# Altium project hri_hand.PrjPcb
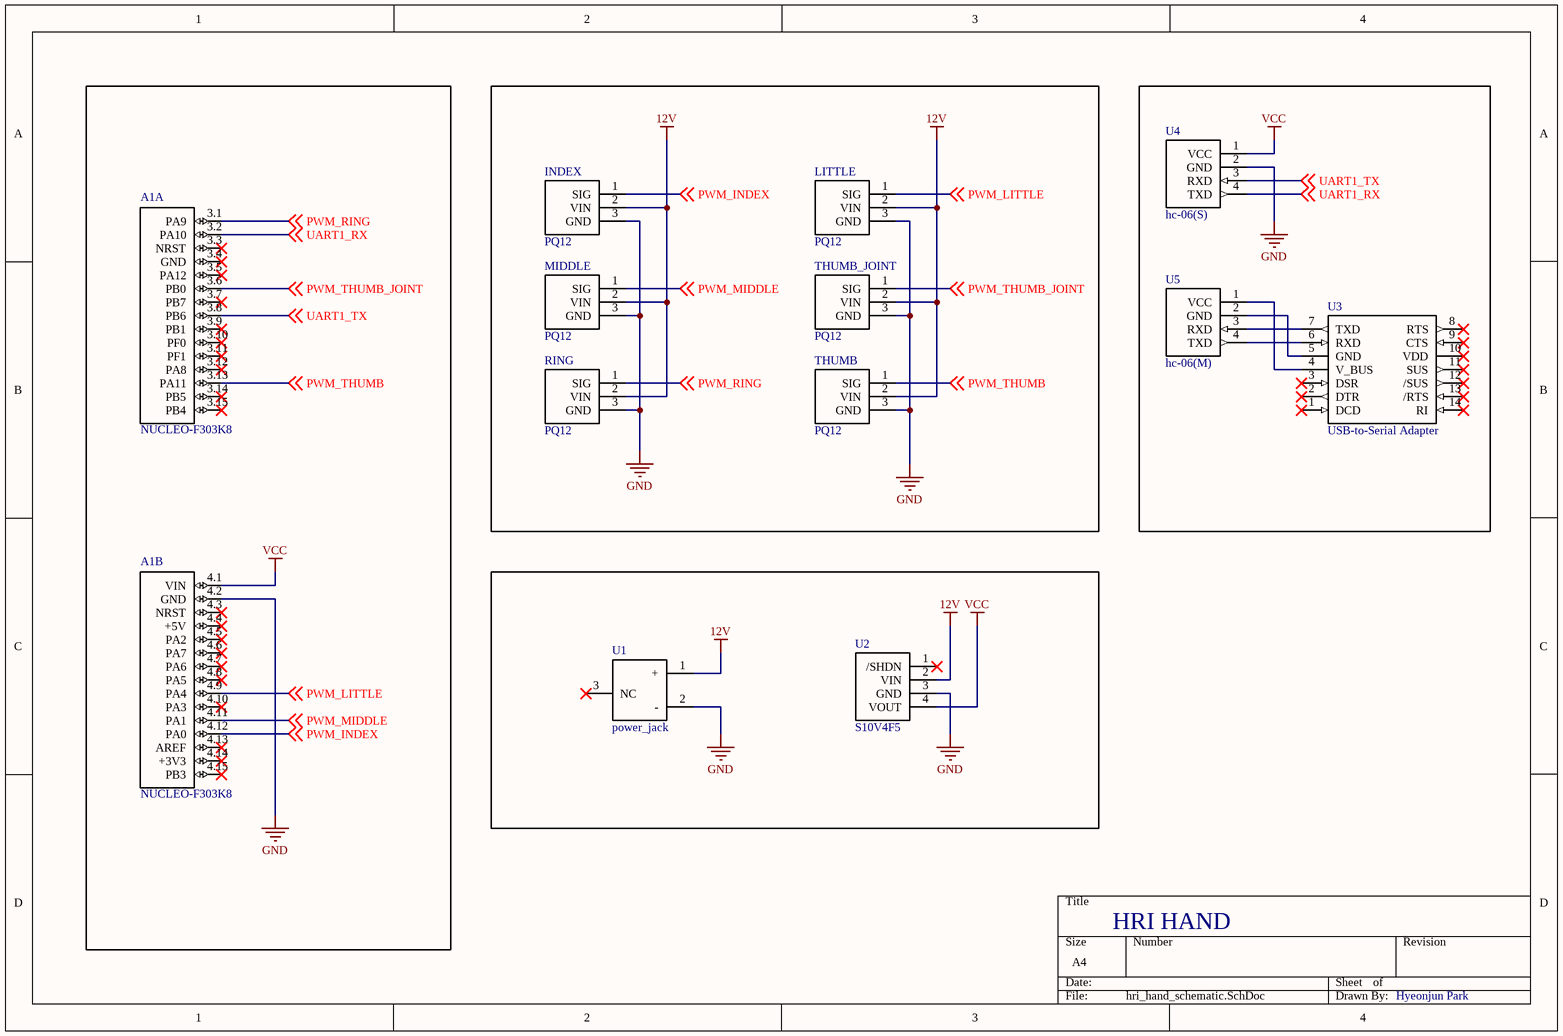
[diagram p0: hri_hand_schematic.SchDoc]
1 sheet, 12 parts. Net scope: global (net labels, ports and power ports of the same name join across sheets).

## Sheet hri_hand_schematic.SchDoc
size A4

### Parts
A1  NUCLEO-F303K8  [*MODULE_NUCLEO-F303K8_NUCLEO-F303K8(Primary)]  (parts A,B of 2)
INDEX  PQ12
LITTLE  PQ12
MIDDLE  PQ12
RING  PQ12
THUMB  PQ12
THUMB_JOINT  PQ12
U1  power_jack
U2  S10V4F5
U3  USB-to-Serial Adapter
U4  hc-06(S)
U5  hc-06(M)

### Nets
12V: INDEX.2(VIN) LITTLE.2(VIN) MIDDLE.2(VIN) RING.2(VIN) THUMB.2(VIN) THUMB_JOINT.2(VIN) U1.1(+) U2.2(VIN)
GND: A1.4.2(GND) INDEX.3(GND) LITTLE.3(GND) MIDDLE.3(GND) RING.3(GND) THUMB.3(GND) THUMB_JOINT.3(GND) U1.2(-) U2.3(GND) U4.2(GND)
VCC: A1.4.1(VIN) U2.4(VOUT) U4.1(VCC)
PWM_INDEX: A1.4.12(PA0) INDEX.1(SIG) ; off-sheet PWM_INDEX
PWM_LITTLE: A1.4.9(PA4) LITTLE.1(SIG) ; off-sheet PWM_LITTLE
PWM_MIDDLE: A1.4.11(PA1) MIDDLE.1(SIG) ; off-sheet PWM_MIDDLE
PWM_RING: A1.3.1(PA9) RING.1(SIG) ; off-sheet PWM_RING
PWM_THUMB: A1.3.13(PA11) THUMB.1(SIG) ; off-sheet PWM_THUMB
PWM_THUMB_JOINT: A1.3.6(PB0) THUMB_JOINT.1(SIG) ; off-sheet PWM_THUMB_JOINT
UART1_RX: A1.3.2(PA10) U4.4(TXD) ; off-sheet UART1_RX
UART1_TX: A1.3.8(PB6) U4.3(RXD) ; off-sheet UART1_TX
NetU3_4: U3.4(V_BUS) U5.1(VCC)
NetU3_5: U3.5(GND) U5.2(GND)
NetU3_6: U3.6(RXD) U5.4(TXD)
NetU3_7: U3.7(TXD) U5.3(RXD)

Not connected (* = marked no-connect by the designer): A1 3.3(NRST)* 3.4(GND)* 3.5(PA12)* 3.7(PB7)* 3.9(PB1)* 3.10(PF0)* 3.11(PF1)* 3.12(PA8)* 3.14(PB5)* 3.15(PB4)* 4.3(NRST)* 4.4(+5V)* 4.5(PA2)* 4.6(PA7)* 4.7(PA6)* 4.8(PA5)* 4.10(PA3)* 4.13(AREF)* 4.14(+3V3)* 4.15(PB3)*; U1 3(NC)*; U2 1(/SHDN)*; U3 1(DCD)* 2(DTR)* 3(DSR)* 8(RTS)* 9(CTS)* 10(VDD)* 11(SUS)* 12(/SUS)* 13(/RTS)* 14(RI)*

### Notes on the sheet
- HRI HAND
- Hyeonjun Park

### Library data of the parts
A1 = NUCLEO-F303K8: STM32 Nucleo-32 development board with STM32F303K8T6 MCU, supports Arduino connectivity; MF: STMicroelectronics; MP: NUCLEO-F303K8; Digi-Key_Purchase_URL: https://www.digikey.kr/product-detail/en/stmicroelectronics/NUCLEO-F303K8/497-15981-ND/5428805?utm_source=snapeda&utm_medium=aggregator&utm_campaign=symbol; SnapEDA_Link: https://www.snapeda.com/parts/NUCLEO-F303K8/STMicroelectronics/view-part/?ref=snap; Package: None; Digi-Key_Part_Number: 497-15981-ND; Value: *
U4 U5 = hc-06